# Altium schematic sheet main.SchDoc
size A4
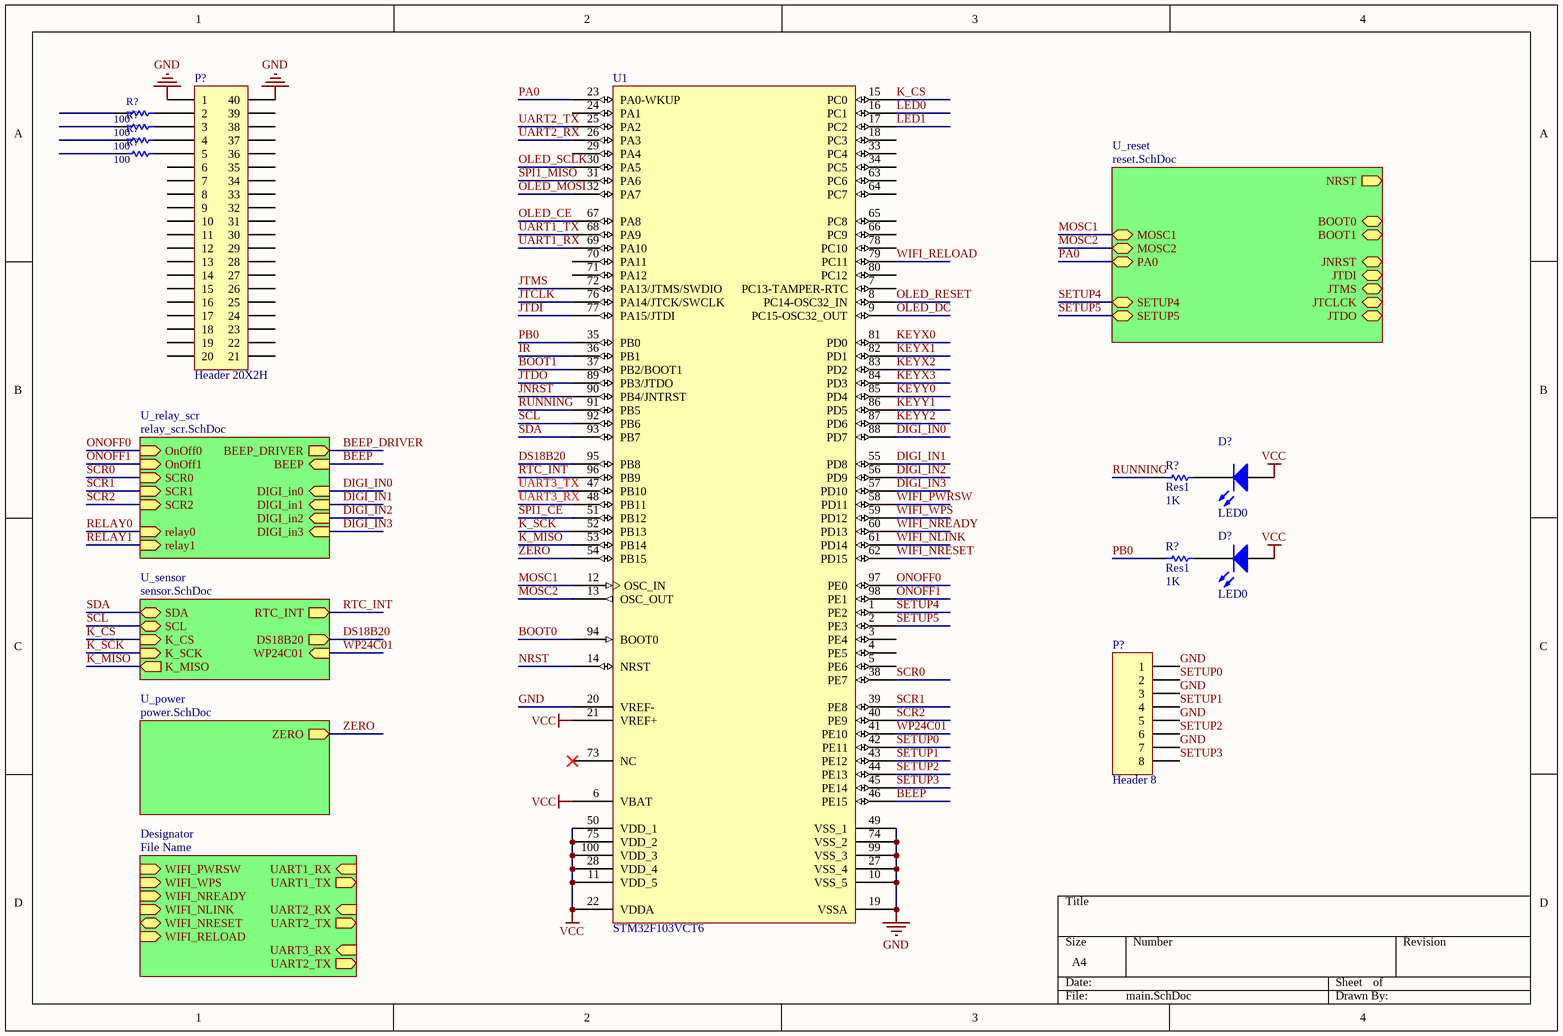
[diagram p0: main.SchDoc]

## Parts
(Parts that share a designator on the sheet are numbered #1, #2 ... from top to bottom, then left to right.)
D?#1  LED0  [LED-0]
D?#2  LED0  [LED-0]
P?#1  Header 20X2H  [HDR2X20H]
P?#2  Header 8  [HDR1X8]
R?#1  value 100  [AXIAL-0.3]  (hidden comment: Res1)
R?#2  value 100  [AXIAL-0.3]  (hidden comment: Res1)
R?#3  value 100  [AXIAL-0.3]  (hidden comment: Res1)
R?#4  value 100  [AXIAL-0.3]  (hidden comment: Res1)
R?#5  Res1  value 1K  [AXIAL-0.3]
R?#6  Res1  value 1K  [AXIAL-0.3]
U1  STM32F103VCT6  [LQFP100_N]

## Sub-sheets
Designator = File Name: WIFI_PWRSW (in), WIFI_WPS (in), WIFI_NREADY (in), WIFI_NLINK (in), WIFI_NRESET, WIFI_RELOAD (in), UART1_RX (in), UART1_TX (out), UART2_RX (in), UART2_TX (out), UART3_RX (in), UART2_TX (out)
U_power = power.SchDoc: ZERO (out)
U_relay_scr = relay_scr.SchDoc: OnOff0 (in), OnOff1 (in), SCR0 (in), SCR1 (in), SCR2 (in), relay0 (in), relay1 (in), BEEP_DRIVER (out), BEEP (in), DIGI_in0 (in), DIGI_in1 (in), DIGI_in2 (in), DIGI_in3 (in)
U_reset = reset.SchDoc: NRST (out), BOOT0, BOOT1, JNRST, JTDI, JTMS, JTCLCK, JTDO, MOSC1, MOSC2, PA0, SETUP4, SETUP5
U_sensor = sensor.SchDoc: SDA, SCL, K_CS (in), K_SCK (in), K_MISO (out), RTC_INT (out), DS18B20 (out), WP24C01 (in)

## Nets
GND: P?#1.1 P?#1.40 P?#2.1 P?#2.3 P?#2.5 P?#2.7 U1.10(VSS_5) U1.19(VSSA) U1.20(VREF-) U1.27(VSS_4) U1.49(VSS_1) U1.74(VSS_2) U1.99(VSS_3)
VCC: D?#1.1(A) D?#2.1(A) U1.6(VBAT) U1.11(VDD_5) U1.21(VREF+) U1.22(VDDA) U1.28(VDD_4) U1.50(VDD_1) U1.75(VDD_2) U1.100(VDD_3)
BEEP: U1.46(PE15) ; sheet U_relay_scr/BEEP
BEEP_DRIVER: sheet U_relay_scr/BEEP_DRIVER
BOOT0: U1.94(BOOT0)
BOOT1: U1.37(PB2/BOOT1)
DIGI_IN0: U1.88(PD7) ; sheet U_relay_scr/DIGI_in0
DIGI_IN1: U1.55(PD8) ; sheet U_relay_scr/DIGI_in1
DIGI_IN2: U1.56(PD9) ; sheet U_relay_scr/DIGI_in2
DIGI_IN3: U1.57(PD10) ; sheet U_relay_scr/DIGI_in3
DS18B20: U1.95(PB8) ; sheet U_sensor/DS18B20
IR: U1.36(PB1)
JNRST: U1.90(PB4/JNTRST)
JTCLK: U1.76(PA14/JTCK/SWCLK)
JTDI: U1.77(PA15/JTDI)
JTDO: U1.89(PB3/JTDO)
JTMS: U1.72(PA13/JTMS/SWDIO)
K_CS: U1.15(PC0) ; sheet U_sensor/K_CS
K_MISO: U1.53(PB14) ; sheet U_sensor/K_MISO
K_SCK: U1.52(PB13) ; sheet U_sensor/K_SCK
KEYX0: U1.81(PD0)
KEYX1: U1.82(PD1)
KEYX2: U1.83(PD2)
KEYX3: U1.84(PD3)
KEYY0: U1.85(PD4)
KEYY1: U1.86(PD5)
KEYY2: U1.87(PD6)
LED0: U1.16(PC1)
LED1: U1.17(PC2)
MOSC1: U1.12(OSC_IN) ; sheet U_reset/MOSC1
MOSC2: U1.13(OSC_OUT) ; sheet U_reset/MOSC2
NRST: U1.14(NRST)
OLED_CE: U1.67(PA8)
OLED_DC: U1.9(PC15-OSC32_OUT)
OLED_MOSI: U1.32(PA7)
OLED_RESET: U1.8(PC14-OSC32_IN)
OLED_SCLK: U1.30(PA5)
ONOFF0: U1.97(PE0) ; sheet U_relay_scr/OnOff0
ONOFF1: U1.98(PE1) ; sheet U_relay_scr/OnOff1
PA0: U1.23(PA0-WKUP) ; sheet U_reset/PA0
PB0: R?#6.1 U1.35(PB0)
RELAY0: sheet U_relay_scr/relay0
RELAY1: sheet U_relay_scr/relay1
RTC_INT: U1.96(PB9) ; sheet U_sensor/RTC_INT
RUNNING: R?#5.1 U1.91(PB5)
SCL: U1.92(PB6) ; sheet U_sensor/SCL
SCR0: U1.38(PE7) ; sheet U_relay_scr/SCR0
SCR1: U1.39(PE8) ; sheet U_relay_scr/SCR1
SCR2: U1.40(PE9) ; sheet U_relay_scr/SCR2
SDA: U1.93(PB7) ; sheet U_sensor/SDA
SETUP0: P?#2.2 U1.42(PE11)
SETUP1: P?#2.4 U1.43(PE12)
SETUP2: P?#2.6 U1.44(PE13)
SETUP3: P?#2.8 U1.45(PE14)
SETUP4: U1.1(PE2) ; sheet U_reset/SETUP4
SETUP5: U1.2(PE3) ; sheet U_reset/SETUP5
SPI1_CE: U1.51(PB12)
SPI1_MISO: U1.31(PA6)
UART1_RX: U1.69(PA10)
UART1_TX: U1.68(PA9)
UART2_RX: U1.26(PA3)
UART2_TX: U1.25(PA2)
UART3_RX: U1.48(PB11)
UART3_TX: U1.47(PB10)
WIFI_NLINK: U1.61(PD14)
WIFI_NREADY: U1.60(PD13)
WIFI_NRESET: U1.62(PD15)
WIFI_PWRSW: U1.58(PD11)
WIFI_RELOAD: U1.79(PC11)
WIFI_WPS: U1.59(PD12)
WP24C01: U1.41(PE10) ; sheet U_sensor/WP24C01
ZERO: U1.54(PB15) ; sheet U_power/ZERO
NetD?#1_2: D?#1.2(K) R?#5.2
NetD?#2_2: D?#2.2(K) R?#6.2
NetP?#1_2: P?#1.2 R?#1.2
NetP?#1_3: P?#1.3 R?#2.2
NetP?#1_4: P?#1.4 R?#3.2
NetP?#1_5: P?#1.5 R?#4.2

Not connected (* = marked no-connect by the designer): P?#1 6 7 8 9 10 11 12 13 14 15 16 17 18 19 20 21 22 23 24 25 26 27 28 29 30 31 32 33 34 35 36 37 38 39; R?#1 1; R?#2 1; R?#3 1; R?#4 1; U1 3(PE4) 4(PE5) 5(PE6) 7(PC13-TAMPER-RTC) 18(PC3) 24(PA1) 29(PA4) 33(PC4) 34(PC5) 63(PC6) 64(PC7) 65(PC8) 66(PC9) 70(PA11) 71(PA12) 73(NC)* 78(PC10) 80(PC12)

## Library data of the parts
D?#1 D?#2 = LED0: Typical INFRARED GaAs LED; Published: 8-Jun-2000; LatestRevisionDate: 08-Jul-2005; LatestRevisionNote: Mech Layer 1 removed.; PackageReference: LED-0; Publisher: Altium Limited; PackageDescription: LED; 2 Leads
P?#1 = Header 20X2H: Header, 20-Pin, Dual row, Right Angle; LatestRevisionDate: 17-Jul-2002; LatestRevisionNote: Re-released for DXP Platform.; Publisher: Altium Limited
P?#2 = Header 8: Header, 8-Pin; LatestRevisionDate: 17-Jul-2002; LatestRevisionNote: Re-released for DXP Platform.; Publisher: Altium Limited
R?#1-R?#6 = Res1: Resistor; Published: 8-Jun-2000; LatestRevisionDate: 17-Jul-2002; LatestRevisionNote: Re-released for DXP Platform.; PackageReference: AXIAL-0.3; Publisher: Altium Limited; PackageDescription: Axial Device, Thru-Hole; 2 Leads; 0.3 in Pin Spacing
U1 = STM32F103VBT6: STM32 ARM-based 32-bit MCU with 64 Kbytes Flash, 100-pin LQFP, Industrial Temperature; Published: 30-May-2008; DatasheetVersion: rev6, Mar-2008; PackageVersion: Mar-2008; PackageReference: LQFP100; Publisher: Altium Limited; PackageDescription: 100-Pin Low-Profile Quad Flat Pack, 14 x 14 mm Body, 0.5 mm Pitch (LQFP100); ComponentLink1Description: Manufacturer Link; ComponentLink1URL: www.st.com/stm32; ComponentLink2Description: Datasheet; ComponentLink2URL: http://www.st.com/stonline/products/literature/ds/13587.pdf